# Altium schematic sheet Water Level Indicator.SchDoc
size A; SheetNumber: 1; SheetTotal: 1
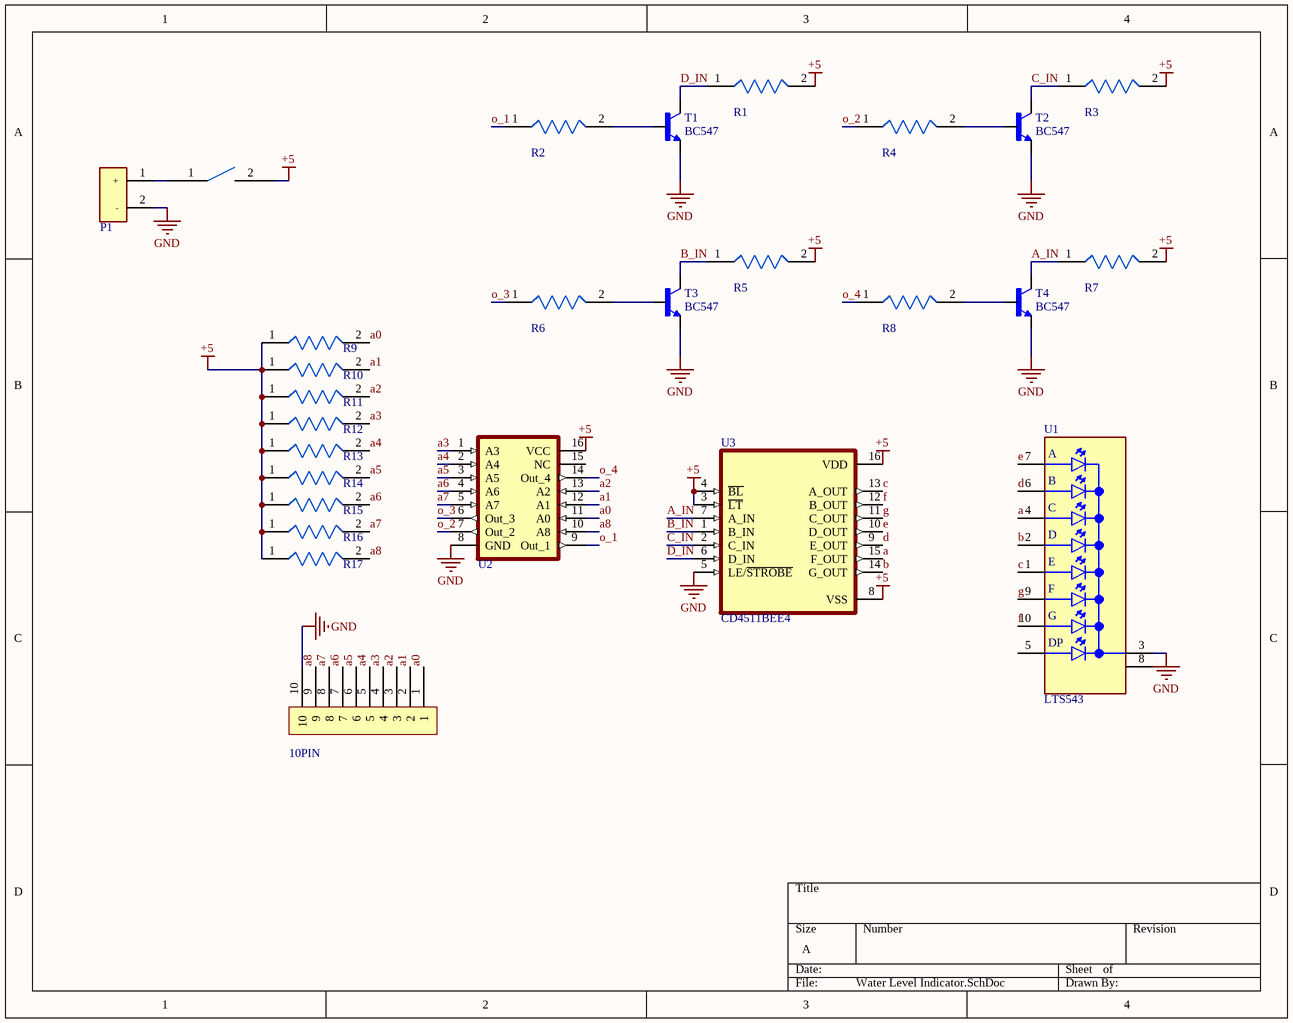
[diagram p0: Water Level Indicator.SchDoc]

## Parts
*  10PIN  [10PIN]
P1  HEADER, 2 PINS  [XT60 Male]  (value not drawn)
R1  Resistor (33k)  [Resistor (33k)]  (value not drawn)
R2  Resistor (12k)  [Resistor (12k)]  (value not drawn)
R3  Resistor (33k)  [Resistor (33k)]  (value not drawn)
R4  Resistor (12k)  [Resistor (12k)]  (value not drawn)
R5  Resistor (33k)  [Resistor (33k)]  (value not drawn)
R6  Resistor (12k)  [Resistor (12k)]  (value not drawn)
R7  Resistor (33k)  [Resistor (33k)]  (value not drawn)
R8  Resistor (12k)  [Resistor (12k)]  (value not drawn)
R9  Resistor (560k)  [Resistor (560k)]  (value not drawn)
R10  Resistor (560k)  [Resistor (560k)]  (value not drawn)
R11  Resistor (560k)  [Resistor (560k)]  (value not drawn)
R12  Resistor (560k)  [Resistor (560k)]  (value not drawn)
R13  Resistor (560k)  [Resistor (560k)]  (value not drawn)
R14  Resistor (560k)  [Resistor (560k)]  (value not drawn)
R15  Resistor (560k)  [Resistor (560k)]  (value not drawn)
R16  Resistor (560k)  [Resistor (560k)]  (value not drawn)
R17  Resistor (560k)  [Resistor (560k)]  (value not drawn)
Switch  Switch  [Switch]  (value not drawn)
T1  BC547  [BC547]
T2  BC547  [BC547]
T3  BC547  [BC547]
T4  BC547  [BC547]
U1  LTS543  [LTS543]
U2  74HC147  [74HC147]  (value not drawn)
U3  CD4511BEE4  [CD4511BE]

## Nets
+5: R1.2 R3.2 R5.2 R7.2 R9.1 R10.1 R11.1 R12.1 R13.1 R14.1 R15.1 R16.1 R17.1 Switch.2 U2.16(VCC) U3.3(~{LT}) U3.4(~{BL}) U3.8(VSS) U3.16(VDD)
GND: *.10 P1.2(-) T1.E T2.E T3.E T4.E U1.3(CC) U2.8(GND) U3.5(LE/~{STROBE})
a: U1.4(C) U3.15(F_OUT)
a0: *.1 R9.2 U2.11(A0)
a1: *.2 R10.2 U2.12(A1)
a2: *.3 R11.2 U2.13(A2)
a3: *.4 R12.2 U2.1(A3)
a4: *.5 R13.2 U2.2(A4)
a5: *.6 R14.2 U2.3(A5)
a6: *.7 R15.2 U2.4(A6)
a7: *.8 R16.2 U2.5(A7)
a8: *.9 R17.2 U2.10(A8)
A_IN: R7.1 T4.C U3.7(A_IN)
b: U1.2(D) U3.14(G_OUT)
B_IN: R5.1 T3.C U3.1(B_IN)
c: U1.1(E) U3.13(A_OUT)
C_IN: R3.1 T2.C U3.2(C_IN)
d: U1.6(B) U3.9(E_OUT)
D_IN: R1.1 T1.C U3.6(D_IN)
e: U1.7(A) U3.10(D_OUT)
f: U1.10(G) U3.12(B_OUT)
g: U1.9(F) U3.11(C_OUT)
o_1: R2.1 U2.9(Out_1)
o_2: R4.1 U2.7(Out_2)
o_3: R6.1 U2.6(Out_3)
o_4: R8.1 U2.14(Out_4)
NetP1_1: P1.1(+) Switch.1
NetR2_2: R2.2 T1.B
NetR4_2: R4.2 T2.B
NetR6_2: R6.2 T3.B
NetR8_2: R8.2 T4.B

Not connected (* = marked no-connect by the designer): U1 5(DP) 8(CC); U2 15(NC)

## Library data of the parts
P1 = XT60 MALE: CONNECTOR
Switch = Switch: Rocker Switch
T1-T4 = BC547: Trans GP BJT NPN 45V 0.1A 500mW 3-Pin TO-92 T/R; MF: ON Semiconductor; Value: *; SnapEDA_Link: https://www.snapeda.com/parts/BC547/Onsemi/view-part/?ref=snap; MP: BC547; Check_prices: https://www.snapeda.com/parts/BC547/Onsemi/view-part/?ref=eda; Availability: In Stock; Price: None; Purchase-URL: https://pricing.snapeda.com/search/part/BC547/?ref=eda; Package: None
U1 = LTS543: DISPLAY, 7 SEGMENT, 14.2MM, GREEN; LED Colour:Green; Forward Current If:10mA; Forward Voltage:2.2V; Luminous Intensity:3.5mcd; No. of Digits / Alpha:1; Character Size:14.2mm; Common Connection:Common Cathode; Product Range:-; SVHC:No SVHC (27-Jun-2018); MF: Lumex Optoelectronics; MP: LDSC512RI; SnapEDA_Link: https://www.snapeda.com/parts/LDSC512RI/Lumex/view-part/?ref=snap; Package: DIP-10 Lumex; Value: *; Check_prices: https://www.snapeda.com/parts/LDSC512RI/Lumex/view-part/?ref=eda
U2 = 74HC147: MP: CD4511BEE4; MF: Texas Instruments; Availability: In Stock; SnapEDA_Link: https://www.snapeda.com/parts/CD4511BEE4/Texas+Instruments/view-part/?ref=snap; Package: PDIP-16 Texas Instruments; Purchase-URL: https://pricing.snapeda.com/search/part/CD4511BEE4/?ref=eda; Price: None; Check_prices: https://www.snapeda.com/parts/CD4511BEE4/Texas+Instruments/view-part/?ref=eda; Value: *
U3 = CD4511BEE4: CMOS BCD-to-7-Segment LED Latch Decoder Drivers 16-PDIP -55 to 125; MF: Texas Instruments; MP: CD4511BEE4; Availability: In Stock; SnapEDA_Link: https://www.snapeda.com/parts/CD4511BEE4/Texas+Instruments/view-part/?ref=snap; Package: PDIP-16 Texas Instruments; Purchase-URL: https://pricing.snapeda.com/search/part/CD4511BEE4/?ref=eda; Price: None; Check_prices: https://www.snapeda.com/parts/CD4511BEE4/Texas+Instruments/view-part/?ref=eda; Value: *